# EAGLE schematic LnControlPanel (EAGLE 9.6.2)

## Sheet 1 of 3
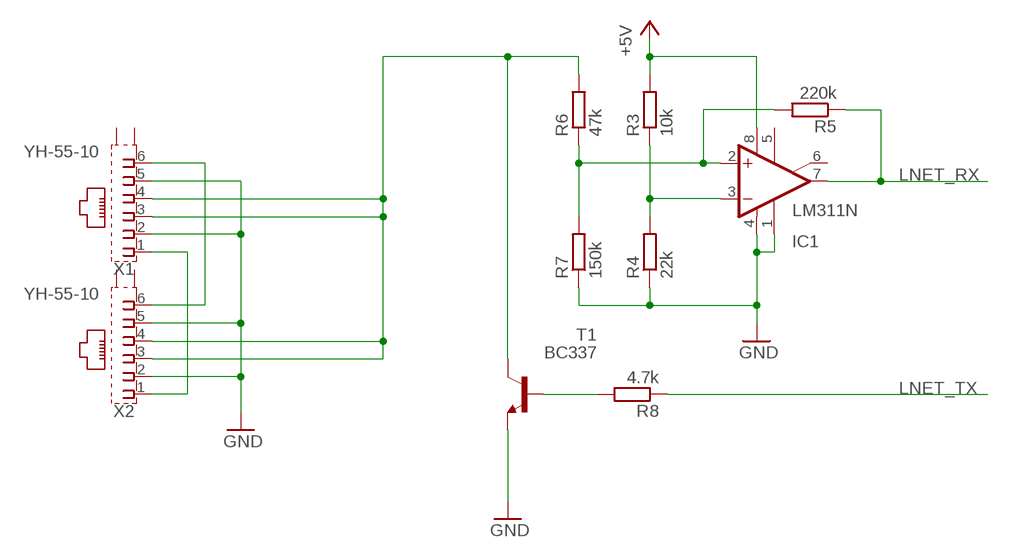
[diagram p0: schematic, sheet 1]

### Parts
IC1  LM311N  [DIL08]
R3  10k  R-EU_0207/2V  [0207/2V]
R4  22k  R-EU_0207/2V  [0207/2V]
R5  220k  R-EU_0207/2V  [0207/2V]
R6  47k  R-EU_0207/2V  [0207/2V]
R7  150k  R-EU_0207/2V  [0207/2V]
R8  4.7k  R-EU_0207/2V  [0207/2V]
T1  BC337  [TO92]
X1  YH-55-10  [YH-55-10]
X2  YH-55-10  [YH-55-10]

### Nets
+5V [power]: IC1.8(V+) R3.2 ; also sheet 2,3
GND [power]: IC1.1(GND) IC1.4(V-) R4.1 R7.1 T1.1(E) X1.2 X1.5 X2.2 X2.5 ; also sheet 2,3
LNET: R6.2 T1.3(C) X1.3 X1.4 X2.3 X2.4
LNET_RX: IC1.7(OUT) R5.1 ; also sheet 2
LNET_TX: R8.1 ; also sheet 2
N$1: R8.2 T1.2(B)
N$3: IC1.3(-IN) R3.1 R4.2
N$5: IC1.2(+IN) R5.2 R6.1 R7.2
N$41: X1.1 X2.1
N$42: X1.6 X2.6
Unconnected: IC1.5(ON) IC1.6(ON/STR) X1.S1(S) X1.S2(S) X2.S1(S) X2.S2(S)

## Sheet 2 of 3
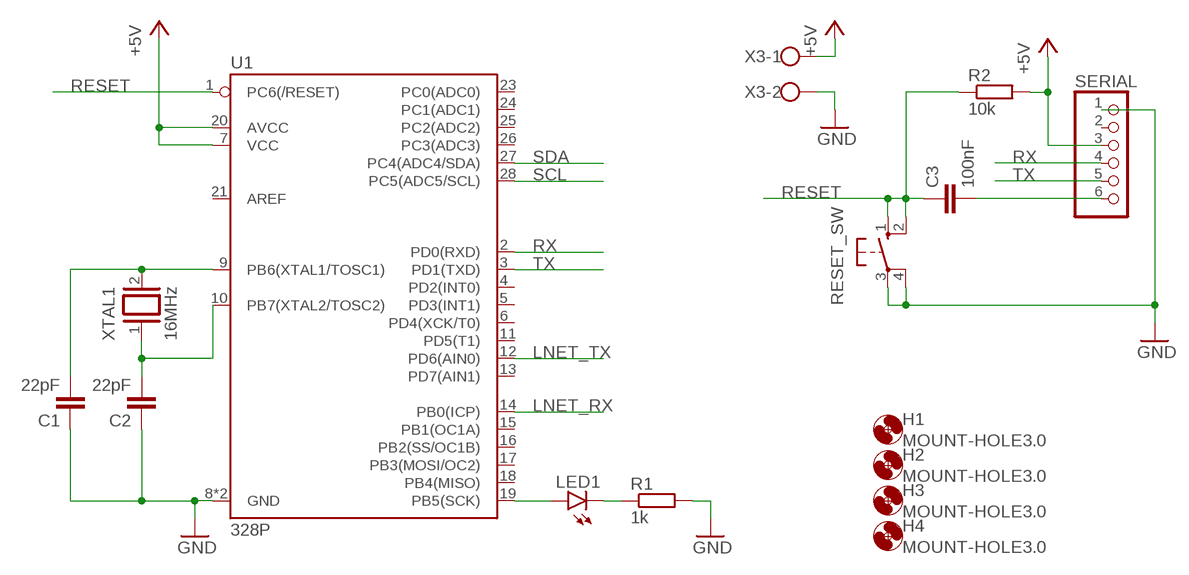
[diagram p1: schematic, sheet 2]

### Parts
C1  22pF  C-EU025-025X050  [C025-025X050]
C2  22pF  C-EU025-025X050  [C025-025X050]
C3  100nF  C-EU050-030X075  [C050-030X075]
H1  MOUNT-HOLE3.0  [3,0]
H2  MOUNT-HOLE3.0  [3,0]
H3  MOUNT-HOLE3.0  [3,0]
H4  MOUNT-HOLE3.0  [3,0]
LED1  LED3MM  [LED3MM]
R1  1k  R-EU_0207/2V  [0207/2V]
R2  10k  R-EU_0207/2V  [0207/2V]
RESET_SW  10-XX  [B3F-10XX]
SERIAL  PINHD-1X6  [1X06]
U1  328P  ATMEGA328P_PDIP  [DIP28]
X3  W237-102  [W237-102]
XTAL1  16MHz  XTAL/S  [QS]

### Nets
+5V [power]: R2.2 SERIAL.3 U1.7(VCC) U1.20(AVCC) X3.1 ; also sheet 1,3
GND [power]: C1.1 C2.1 R1.2 RESET_SW.3(P) RESET_SW.4(P1) SERIAL.1 U1.8(GND) U1.22(GND) X3.2 ; also sheet 1,3
LNET_RX: U1.14(PB0(ICP)) ; also sheet 1
LNET_TX: U1.12(PD6(AIN0)) ; also sheet 1
N$2: C2.2 U1.10(PB7(XTAL2/TOSC2)) XTAL1.1
N$4: C1.2 U1.9(PB6(XTAL1/TOSC1)) XTAL1.2
N$38: C3.2 SERIAL.6
N$39: LED1.A U1.19(PB5(SCK))
N$40: LED1.K(C) R1.1
RESET: C3.1 R2.1 RESET_SW.1(S) RESET_SW.2(S1) U1.1(PC6(/RESET))
RX: SERIAL.4 U1.2(PD0(RXD))
SCL: U1.28(PC5(ADC5/SCL)) ; also sheet 3
SDA: U1.27(PC4(ADC4/SDA)) ; also sheet 3
TX: SERIAL.5 U1.3(PD1(TXD))
Unconnected: SERIAL.2 U1.4(PD2(INT0)) U1.5(PD3(INT1)) U1.6(PD4(XCK/T0)) U1.11(PD5(T1)) U1.13(PD7(AIN1)) U1.15(PB1(OC1A)) U1.16(PB2(SS/OC1B)) U1.17(PB3(MOSI/OC2)) U1.18(PB4(MISO)) U1.21(AREF) U1.23(PC0(ADC0)) U1.24(PC1(ADC1)) U1.25(PC2(ADC2)) U1.26(PC3(ADC3))

## Sheet 3 of 3
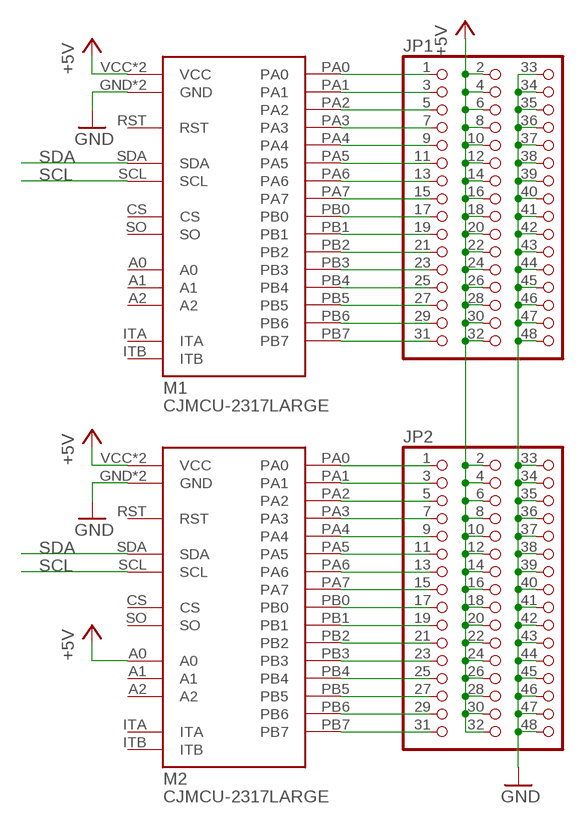
[diagram p2: schematic, sheet 3]

### Parts
JP1  PINHD-3X16  [3X16]
JP2  PINHD-3X16  [3X16]
M1  CJMCU-2317LARGE  [CJMCU-2317-PACKAGE2]
M2  CJMCU-2317LARGE  [CJMCU-2317-PACKAGE2]

### Nets
+5V [power]: JP1.2 JP1.4 JP1.6 JP1.8 JP1.10 JP1.12 JP1.14 JP1.16 JP1.18 JP1.20 JP1.22 JP1.24 JP1.26 JP1.28 JP1.30 JP1.32 JP2.2 JP2.4 JP2.6 JP2.8 JP2.10 JP2.12 JP2.14 JP2.16 JP2.18 JP2.20 JP2.22 JP2.24 JP2.26 JP2.28 JP2.30 JP2.32 M1.VCC M1.VCC_2(VCC) M2.A0 M2.VCC M2.VCC_2(VCC) ; also sheet 1,2
GND [power]: JP1.33 JP1.34 JP1.35 JP1.36 JP1.37 JP1.38 JP1.39 JP1.40 JP1.41 JP1.42 JP1.43 JP1.44 JP1.45 JP1.46 JP1.47 JP1.48 JP2.33 JP2.34 JP2.35 JP2.36 JP2.37 JP2.38 JP2.39 JP2.40 JP2.41 JP2.42 JP2.43 JP2.44 JP2.45 JP2.46 JP2.47 JP2.48 M1.GND M1.GND_2(GND) M2.GND M2.GND_2(GND) ; also sheet 1,2
N$6: JP1.1 M1.PA0
N$7: JP1.3 M1.PA1
N$8: JP1.5 M1.PA2
N$9: JP1.7 M1.PA3
N$10: JP1.9 M1.PA4
N$11: JP1.11 M1.PA5
N$12: JP1.13 M1.PA6
N$13: JP1.15 M1.PA7
N$14: JP1.17 M1.PB0
N$15: JP1.19 M1.PB1
N$16: JP1.21 M1.PB2
N$17: JP1.23 M1.PB3
N$18: JP1.25 M1.PB4
N$19: JP1.27 M1.PB5
N$20: JP1.29 M1.PB6
N$21: JP1.31 M1.PB7
N$22: JP2.1 M2.PA0
N$23: JP2.3 M2.PA1
N$24: JP2.5 M2.PA2
N$25: JP2.7 M2.PA3
N$26: JP2.9 M2.PA4
N$27: JP2.11 M2.PA5
N$28: JP2.13 M2.PA6
N$29: JP2.15 M2.PA7
N$30: JP2.17 M2.PB0
N$31: JP2.19 M2.PB1
N$32: JP2.21 M2.PB2
N$33: JP2.23 M2.PB3
N$34: JP2.25 M2.PB4
N$35: JP2.27 M2.PB5
N$36: JP2.29 M2.PB6
N$37: JP2.31 M2.PB7
SCL: M1.SCL M2.SCL ; also sheet 2
SDA: M1.SDA M2.SDA ; also sheet 2
Unconnected: M1.A0 M1.A1 M1.A2 M1.CS M1.ITA M1.ITB M1.RST M1.SO M2.A1 M2.A2 M2.CS M2.ITA M2.ITB M2.RST M2.SO

## Library data of the parts
C1-C3 = rcl:C-EU: CAPACITOR, European symbol; SPICEPREFIX: C
H1-H4 = holes:MOUNT-HOLE: MOUNTING HOLE with drill center marker
IC1 = linear:LM311: COMPARATOR
JP1 JP2 = LucaDentella:PINHD-3X16: PIN HEADER
LED1 = led:LED: LED OSRAM: - CHIPLED LG R971, LG N971, LY N971, LG Q971, LY Q971, LO R971, LY R971 LH N974, LH R974 LS Q976, LO Q976, LY Q976 LO Q996 - Hyper CHIPLED LW Q18S LB Q993, LB Q99A, LB R99A - SideLED LS A670, LO A670, LY A670, LG A670, LP A670 LB A673, LV A673, LT A673, LW A673 LH A674 LY A675 LS A676, LA A676, LO A676, LY A676, LW A676 LS A679, LY A679, LG A679 - Hyper Micro SIDELED® LS Y876, LA Y876, LO Y876, LY Y876 LT Y87S - SmartLED LW L88C, LW L88S LB L89C, LB L89S, LG L890 LS L89K, LO L89K, LY L89K LS L896, LA L896, LO L896, LY L896 - TOPLED LS T670, LO T670, LY T670, LG T670, LP T670 LSG T670, LSP T670, LSY T670, LOP T670, LYG T670 LG T671, LOG T671, LSG T671 LB T673, LV T673, LT T673, LW T673 LH T674 LS T676, LA T676, LO T676, LY T676, LB T676, LH T676, LSB T676, LW T676 LB T67C, LV T67C, LT T67C, LS T67K, LO T67K, LY T67K, LW E67C LS E67B, LA E67B, LO E67B, LY E67B, LB E67C, LV E67C, LT E67C LW T67C LS T679, LY T679, LG T679 LS T770, LO T770, LY T770, LG T770, LP T770 LB T773, LV T773, LT T773, LW T773 LH T774 LS E675, LA E675, LY E675, LS T675 LS T776, LA T776, LO T776, LY T776, LB T776 LHGB T686 LT T68C, LB T68C - Hyper Mini TOPLED® LB M676 - Mini TOPLED Santana® LG M470 LS M47K, LO M47K, LY M47K Source: http://www.osram.convergy.de LUXEON: - LUMILED® LXK2-PW12-R00, LXK2-PW12-S00, LXK2-PW14-U00, LXK2-PW14-V00 LXK2-PM12-R00, LXK2-PM12-S00, LXK2-PM14-U00 LXK2-PE12-Q00, LXK2-PE12-R00, LXK2-PE12-S00, LXK2-PE14-T00, LXK2-PE14-U00 LXK2-PB12-K00, LXK2-PB12-L00, LXK2-PB12-M00, LXK2-PB14-N00, LXK2-PB14-P00, LXK2-PB14-Q00 LXK2-PR12-L00, LXK2-PR12-M00, LXK2-PR14-Q00, LXK2-PR14-R00 LXK2-PD12-Q00, LXK2-PD12-R00, LXK2-PD12-S00 LXK2-PH12-R00, LXK2-PH12-S00 LXK2-PL12-P00, LXK2-PL12-Q00, LXK2-PL12-R00 Source: www.luxeon.com KINGBRIGHT: KA-3528ASYC Source: www.kingbright.com
M1 M2 = LucaDentella:CJMCU-2317
R1 R2 = rcl:R-EU_: RESISTOR, European symbol; SPICEPREFIX: R
R3-R8 = rcl:R-EU_: RESISTOR, European symbol
RESET_SW = switch-omron:10-XX: OMRON SWITCH; MPN: B3F-1000; OC_FARNELL: 176432; OC_NEWARK: 36M3542
SERIAL = pinhead:PINHD-1X6: PIN HEADER
T1 = transistor:BC337: NPN TRANSISTOR
U1 = SparkFun-IC-Microcontroller:ATMEGA328P_PDIP: Atmel 328P Through hole ATMEGA328P uC used in the Arduino 32kb flash, 1k EEPROM, 2k SRAM Datasheet <http://www.sparkfun.com/datasheets/Components/SMD/ATMega328.pdf> SparkFun Products Storefront component: AVR 28 Pin 20MHz 32K 6A/D - ATMega328P <https://www.sparkfun.com/products/9061> (COM-09061) SparkFun Simon Says - Through-Hole Soldering Kit <https://www.sparkfun.com/products/10547> (KIT-10547) SparkFun Learn to Solder - Simon Says <https://www.sparkfun.com/products/13708> (KIT-13708) SparkFun BigTime Watch Kit <https://www.sparkfun.com/products/11734> (KIT-11734) SparkFun ClockIt <https://www.sparkfun.com/products/10930> (KIT-10930) SparkFun Serial Enabled LCD Kit <https://www.sparkfun.com/products/10097> (LCD-10097) SparkFun Simon Tilts - Through Hole Soldering Kit <https://www.sparkfun.com/products/12634> (KIT-12634) SparkFun Frequency Counter Kit <https://www.sparkfun.com/products/10140> (KIT-10140) FabFM Radio Kit <https://www.sparkfun.com/products/11043> (KIT-11043) SparkFun Binary Blaster Kit <https://www.sparkfun.com/products/12037> (KIT-12037) SparkFun Metro-Gnome <https://www.sparkfun.com/products/9236> (KIT-09236) ATmega328 with Arduino Optiboot (Uno) <https://www.sparkfun.com/products/10524> (DEV-10524); PROD_ID: IC-09136
X1 X2 = con-wenzhou-yihua:YH-55-10: RJ11 6 connects Source: YH-55-10.pdf; OC_FARNELL: unknown; OC_NEWARK: unknown
X3 = con-wago-500:W237-102: WAGO SCREW CLAMP; MPN: 237-102; OC_FARNELL: unknown; OC_NEWARK: 70K9898
XTAL1 = special:XTAL/S: CRYSTAL

## Net classes
0 default: width 0.254 mm, clearance 0.254 mm
1 power: width 0.508 mm, clearance 0.254 mm